# EAGLE design Memory Board V2 (EAGLE 6.5.0)
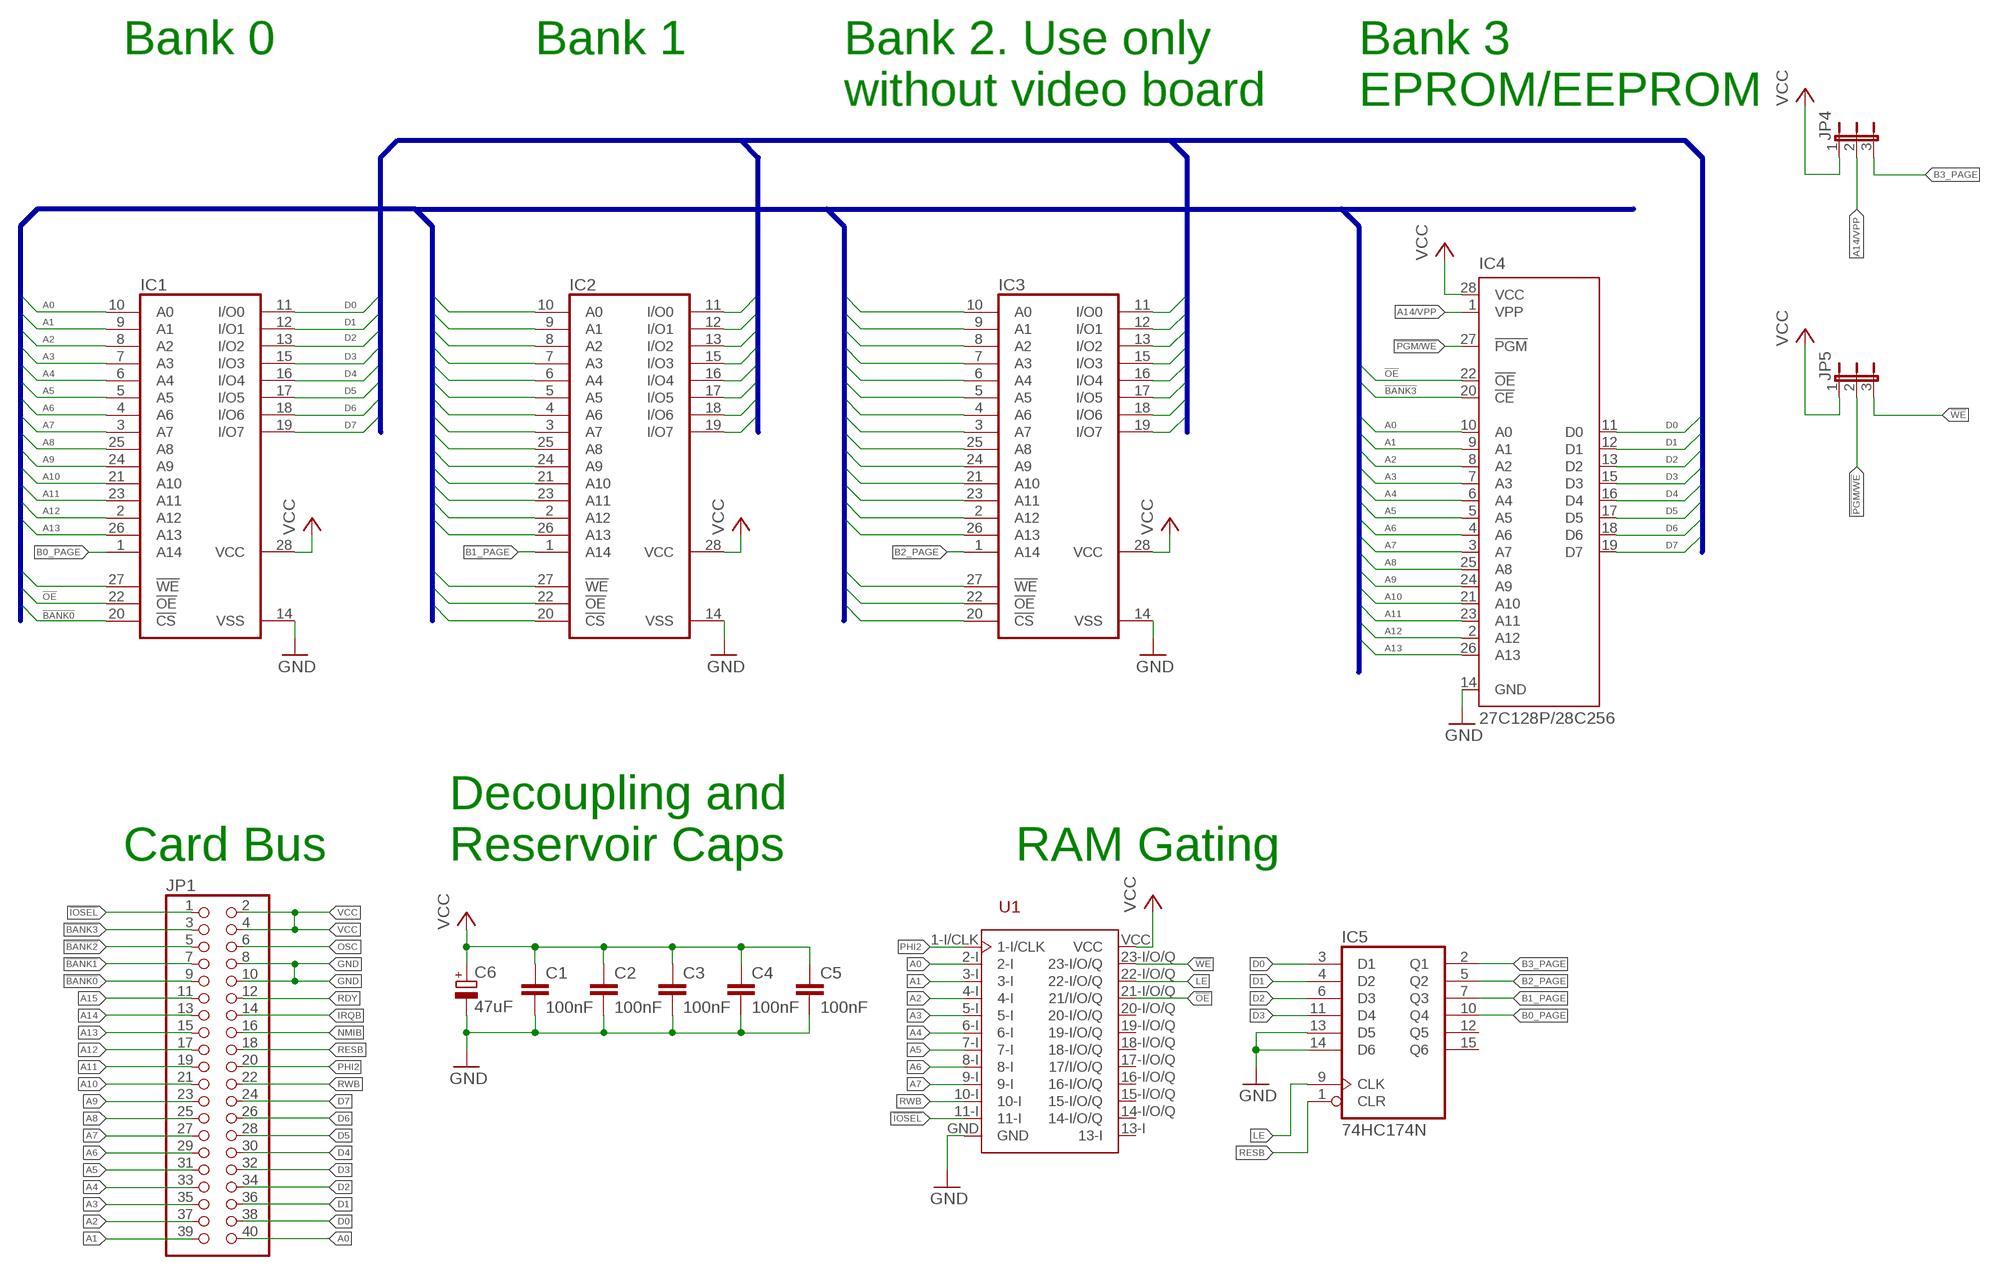
[diagram p0: schematic, sheet 1]

## Parts
C1  100nF  C-EU050-025X075  [C050-025X075]
C2  100nF  C-EU050-025X075  [C050-025X075]
C3  100nF  C-EU050-025X075  [C050-025X075]
C4  100nF  C-EU050-025X075  [C050-025X075]
C5  100nF  C-EU050-025X075  [C050-025X075]
C6  47uF  CPOL-EUE2.5-7  [E2,5-7]
IC1  62256P  [DIL28-6]
IC2  62256P  [DIL28-6]
IC3  62256P  [DIL28-6]
IC4  27C128P/28C256  27C128P  [DIL28-6]
IC5  74HC174N  [DIL16]
JP1  PINHD-2X20/90  [2X20/90]
JP4  JP2E  [JP2]
JP5  JP2E  [JP2]
U1  GAL22V10D-DIP  [DIP24]

## Nets
!BANK0: IC1.20(!CS) JP1.9
!BANK1: IC2.20(!CS) JP1.7
!BANK2: IC3.20(!CS) JP1.5
!BANK3: IC4.20(!CE) JP1.3
!IOSEL: JP1.1 U1.11-I
!OE: IC1.22(!OE) IC2.22(!OE) IC3.22(!OE) IC4.22(!OE) U1.21-I/O/Q(21/I/O/Q)
!PGM/WE: IC4.27(!PGM) JP5.2
!WE: IC1.27(!WE) IC2.27(!WE) IC3.27(!WE) JP5.3 U1.23-I/O/Q
A0: IC1.10(A0) IC2.10(A0) IC3.10(A0) IC4.10(A0) JP1.40 U1.2-I
A1: IC1.9(A1) IC2.9(A1) IC3.9(A1) IC4.9(A1) JP1.39 U1.3-I
A2: IC1.8(A2) IC2.8(A2) IC3.8(A2) IC4.8(A2) JP1.37 U1.4-I
A3: IC1.7(A3) IC2.7(A3) IC3.7(A3) IC4.7(A3) JP1.35 U1.5-I
A4: IC1.6(A4) IC2.6(A4) IC3.6(A4) IC4.6(A4) JP1.33 U1.6-I
A5: IC1.5(A5) IC2.5(A5) IC3.5(A5) IC4.5(A5) JP1.31 U1.7-I
A6: IC1.4(A6) IC2.4(A6) IC3.4(A6) IC4.4(A6) JP1.29 U1.8-I
A7: IC1.3(A7) IC2.3(A7) IC3.3(A7) IC4.3(A7) JP1.27 U1.9-I
A8: IC1.25(A8) IC2.25(A8) IC3.25(A8) IC4.25(A8) JP1.25
A9: IC1.24(A9) IC2.24(A9) IC3.24(A9) IC4.24(A9) JP1.23
A10: IC1.21(A10) IC2.21(A10) IC3.21(A10) IC4.21(A10) JP1.21
A11: IC1.23(A11) IC2.23(A11) IC3.23(A11) IC4.23(A11) JP1.19
A12: IC1.2(A12) IC2.2(A12) IC3.2(A12) IC4.2(A12) JP1.17
A13: IC1.26(A13) IC2.26(A13) IC3.26(A13) IC4.26(A13) JP1.15
A14: JP1.13
A14/VPP: IC4.1(VPP) JP4.2
A15: JP1.11
B0_PAGE: IC1.1(A14) IC5.10(Q4)
B1_PAGE: IC2.1(A14) IC5.7(Q3)
B2_PAGE: IC3.1(A14) IC5.5(Q2)
B3_PAGE: IC5.2(Q1) JP4.3
D0: IC1.11(I/O0) IC2.11(I/O0) IC3.11(I/O0) IC4.11(D0) IC5.3(D1) JP1.38
D1: IC1.12(I/O1) IC2.12(I/O1) IC3.12(I/O1) IC4.12(D1) IC5.4(D2) JP1.36
D2: IC1.13(I/O2) IC2.13(I/O2) IC3.13(I/O2) IC4.13(D2) IC5.6(D3) JP1.34
D3: IC1.15(I/O3) IC2.15(I/O3) IC3.15(I/O3) IC4.15(D3) IC5.11(D4) JP1.32
D4: IC1.16(I/O4) IC2.16(I/O4) IC3.16(I/O4) IC4.16(D4) JP1.30
D5: IC1.17(I/O5) IC2.17(I/O5) IC3.17(I/O5) IC4.17(D5) JP1.28
D6: IC1.18(I/O6) IC2.18(I/O6) IC3.18(I/O6) IC4.18(D6) JP1.26
D7: IC1.19(I/O7) IC2.19(I/O7) IC3.19(I/O7) IC4.19(D7) JP1.24
GND [power]: C1.2 C2.2 C3.2 C4.2 C5.2 C6.- IC1.14(VSS) IC2.14(VSS) IC3.14(VSS) IC4.14(GND) IC5.13(D5) IC5.14(D6) JP1.8 JP1.10 U1.GND
IRQB: JP1.14
LE: IC5.9(CLK) U1.22-I/O/Q
NMIB: JP1.16
OSC: JP1.6
PHI2: JP1.20 U1.1-I/CLK
RDY: JP1.12
RESB: IC5.1(CLR) JP1.18
RWB: JP1.22 U1.10-I
VCC [power]: C1.1 C2.1 C3.1 C4.1 C5.1 C6.+ IC1.28(VCC) IC2.28(VCC) IC3.28(VCC) IC4.28(VCC) JP1.2 JP1.4 JP4.1 JP5.1 U1.VCC
Unconnected: IC5.12(Q5) IC5.15(Q6) U1.13-I U1.14-I/O/Q U1.15-I/O/Q U1.16-I/O/Q U1.17-I/O/Q(17/I/O/Q) U1.18-I/O/Q U1.19-I/O/Q U1.20-I/O/Q

## Buses
D[0..7]
A[0..15],!OE,!BANK0,!BANK1,!BANK2,!BANK3,!WE

## Notes on the sheet
- Bank 0 | Bank 1
- Bank 2. Use only
  without video board
- Bank 3
  EPROM/EEPROM
- Card Bus
- Decoupling and
  Reservoir Caps
- RAM Gating

## Power pins joined to a net without a drawn wire
GND: IC5.8(GND)
VCC: IC5.16(VCC)

## Library data of the parts
C1-C5 = rcl:C-EU: CAPACITOR, European symbol
C6 = rcl:CPOL-EU: POLARIZED CAPACITOR, European symbol
IC1-IC3 = memory-hitachi:62256P: MEMORY; OC_FARNELL: unknown; OC_NEWARK: unknown
IC4 = microchip:27*128: CMOS EPROM 128 K (16 K x 8); OC_FARNELL: unknown; OC_NEWARK: unknown
IC5 = 74xx-eu:74*174: Hex D type FLIP FLOP, clear
JP1 = pinhead:PINHD-2X20: PIN HEADER
JP4 JP5 = jumper:JP2E: JUMPER
U1 = GAL22V10D:GAL22V10D-DIP: GAL22V10 Generic Array Logic

## Net classes
0 signal: width 0.254 mm, clearance 0.305 mm
1 power: width 0.61 mm, clearance 0.305 mm

## Board
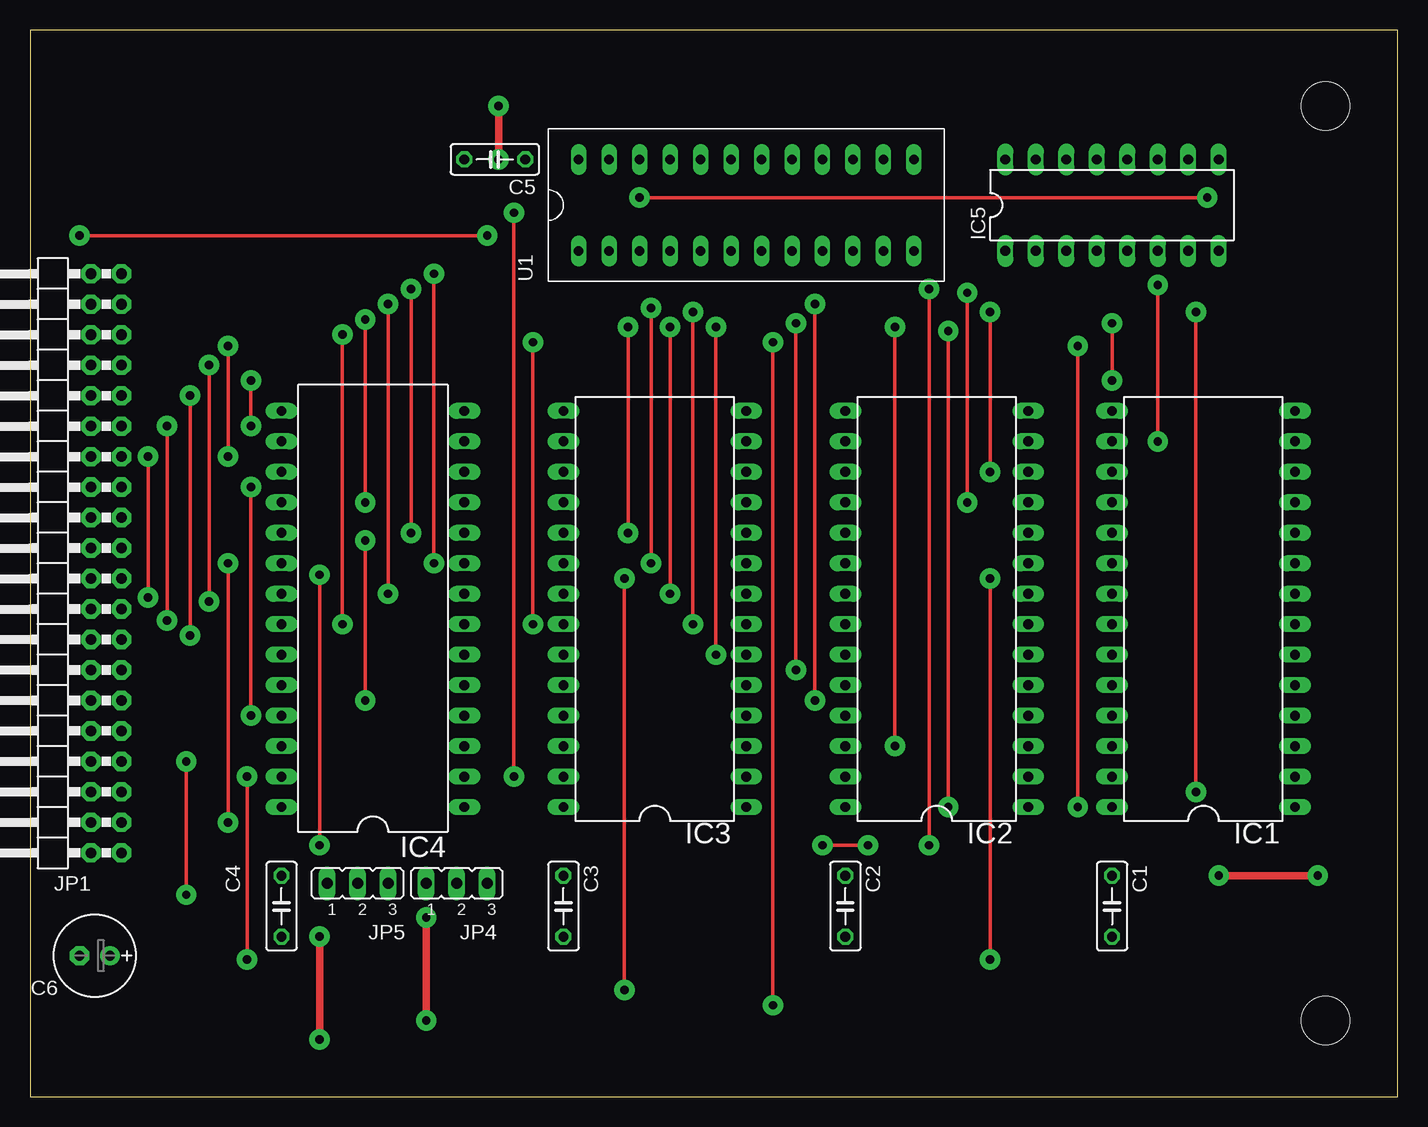
[diagram p1: board, top side]
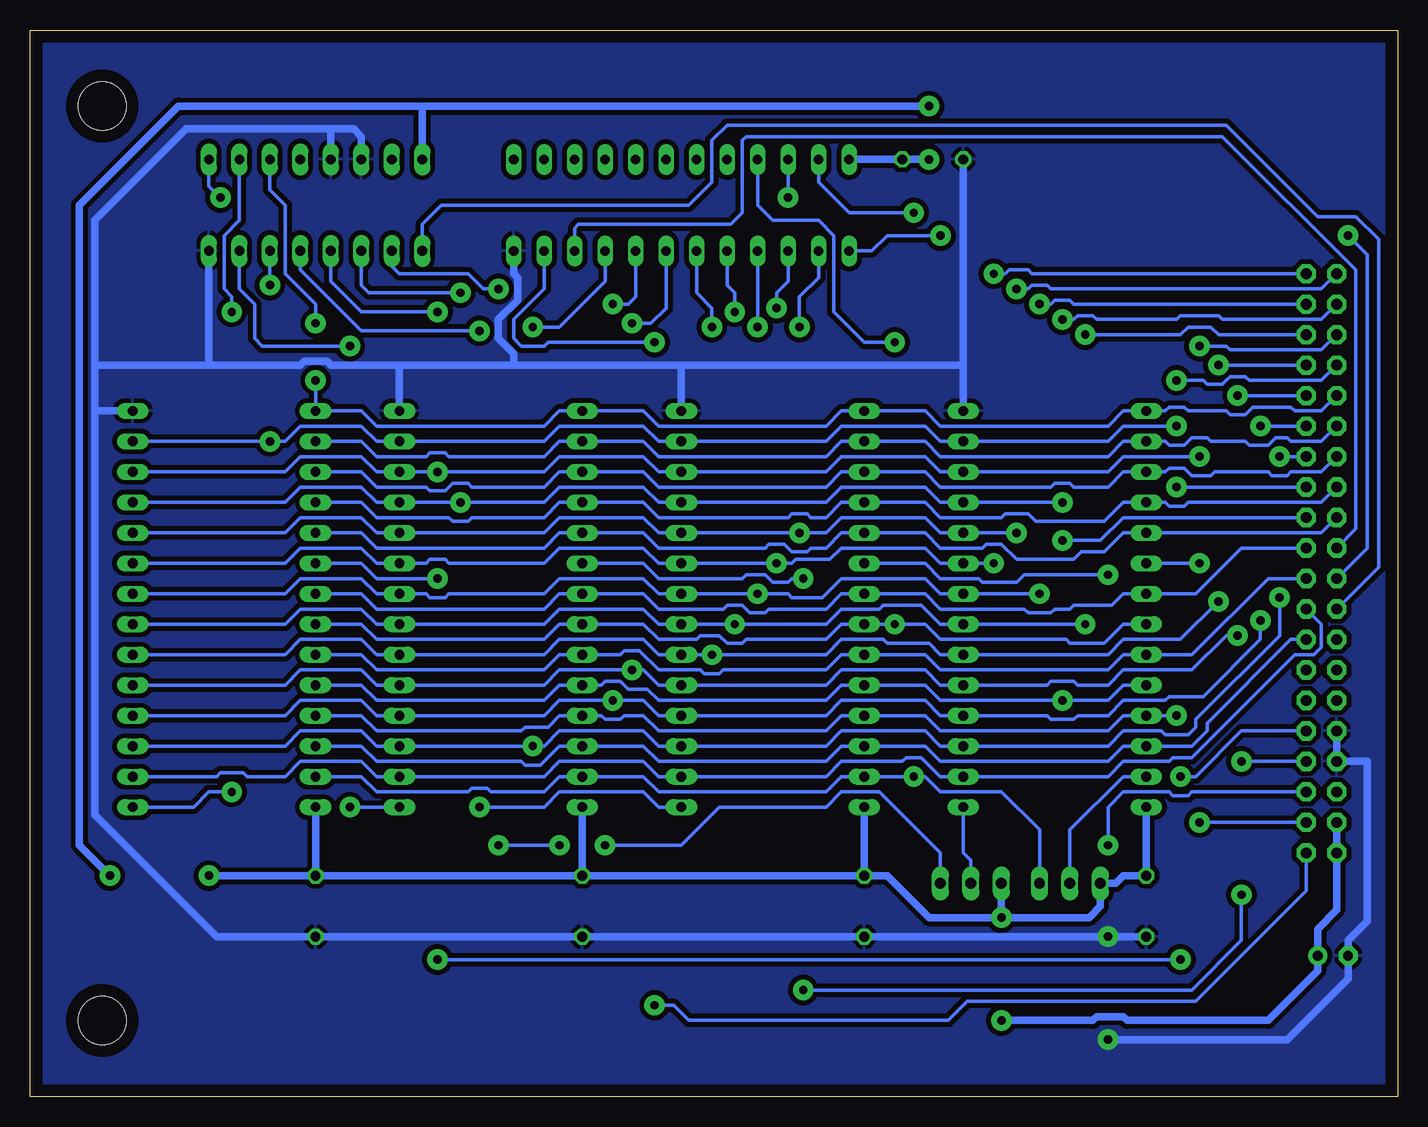
[diagram p2: board, bottom side, seen from below]

Size 113.97 x 88.89 mm. Coordinates in mm from the lower left corner, seen from the top.
Outline: 0,0 113.97,0 113.97,88.89 0,88.89 0,0
Copper layers (1*16): Top 0.035mm / dielectric 1.5mm / Bottom 0.035mm
Design rules "default *": minimum track width 10mil, minimum drill 24mil, track to track 8mil, track to pad 8mil, pad to pad 8mil, via to via 8mil, smd to smd 8mil, copper to edge 40mil, drill to drill 8mil, minimum pad ring 10mil, minimum via ring 16mil, stop-mask expansion 4mil, vias tented up to drill 0mil, thermal gap 14mil
Holes 4 mm at 107.95,82.55 107.95,6.35

### Footprints (pad centres in the part's own frame; a part is rotated, then mirrored left to right if it is on the bottom)
C050-025X075 = drill 0.813 octagon: 1 -2.54,0; 2 2.54,0
E2,5-7 = drill 0.813 pad 1.6: + -1.27,0 | drill 0.813 pad 1.6 octagon: - 1.27,0
DIL28-6 = drill 0.813 long: 1 -16.51,-7.62; 2 -13.97,-7.62; 3 -11.43,-7.62; 4 -8.89,-7.62; 5 -6.35,-7.62; 6 -3.81,-7.62; 7 -1.27,-7.62; 8 1.27,-7.62; 9 3.81,-7.62; 10 6.35,-7.62; 11 8.89,-7.62; 12 11.43,-7.62; 13 13.97,-7.62; 14 16.51,-7.62; 15 16.51,7.62; 16 13.97,7.62; 17 11.43,7.62; 18 8.89,7.62; 19 6.35,7.62; 20 3.81,7.62; 21 1.27,7.62; 22 -1.27,7.62; 23 -3.81,7.62; 24 -6.35,7.62; 25 -8.89,7.62; 26 -11.43,7.62; 27 -13.97,7.62; 28 -16.51,7.62
DIL16 = drill 0.813 long: 1 -8.89,-3.81; 2 -6.35,-3.81; 3 -3.81,-3.81; 4 -1.27,-3.81; 5 1.27,-3.81; 6 3.81,-3.81; 7 6.35,-3.81; 8 8.89,-3.81; 9 8.89,3.81; 10 6.35,3.81; 11 3.81,3.81; 12 1.27,3.81; 13 -1.27,3.81; 14 -3.81,3.81; 15 -6.35,3.81; 16 -8.89,3.81
2X20/90 = drill 0.889 pad 1.6 octagon: 1 -24.13,-6.35; 2 -24.13,-3.81; 3 -21.59,-6.35; 4 -21.59,-3.81; 5 -19.05,-6.35; 6 -19.05,-3.81; 7 -16.51,-6.35; 8 -16.51,-3.81; 9 -13.97,-6.35; 10 -13.97,-3.81; 11 -11.43,-6.35; 12 -11.43,-3.81; 13 -8.89,-6.35; 14 -8.89,-3.81; 15 -6.35,-6.35; 16 -6.35,-3.81; 17 -3.81,-6.35; 18 -3.81,-3.81; 19 -1.27,-6.35; 20 -1.27,-3.81; 21 1.27,-6.35; 22 1.27,-3.81; 23 3.81,-6.35; 24 3.81,-3.81; 25 6.35,-6.35; 26 6.35,-3.81; 27 8.89,-6.35; 28 8.89,-3.81; 29 11.43,-6.35; 30 11.43,-3.81; 31 13.97,-6.35; 32 13.97,-3.81; 33 16.51,-6.35; 34 16.51,-3.81; 35 19.05,-6.35; 36 19.05,-3.81; 37 21.59,-6.35; 38 21.59,-3.81; 39 24.13,-6.35; 40 24.13,-3.81
JP2 = drill 0.914 long: 1 -2.54,0; 2 0,0; 3 2.54,0
DIP24 = drill 0.8 long: 1-I/CLK -3.81,13.97; 2-I -3.81,11.43; 3-I -3.81,8.89; 4-I -3.81,6.35; 5-I -3.81,3.81; 6-I -3.81,1.27; 7-I -3.81,-1.27; 8-I -3.81,-3.81; 9-I -3.81,-6.35; 10-I -3.81,-8.89; 11-I -3.81,-11.43; 13-I 3.81,-13.97; 14-I/O/Q 3.81,-11.43; 15-I/O/Q 3.81,-8.89; 16-I/O/Q 3.81,-6.35; 17-I/O/Q 3.81,-3.81; 18-I/O/Q 3.81,-1.27; 19-I/O/Q 3.81,1.27; 20-I/O/Q 3.81,3.81; 21-I/O/Q 3.81,6.35; 22-I/O/Q 3.81,8.89; 23-I/O/Q 3.81,11.43; GND -3.81,-13.97; VCC 3.81,13.97

### Placement (x,y rotation side)
C1  90.17,15.88 270 top
C2  67.94,15.88 270 top
C3  44.45,15.88 270 top
C4  20.95,15.88 270 top
C5  38.73,78.11 180 top
C6  5.4,11.75 180 top
IC1  97.79,40.64 90 top
IC2  75.56,40.64 90 top
IC3  52.07,40.64 90 top
IC4  28.57,40.64 90 top
IC5  90.17,74.3 0 top
JP1  1.27,44.45 90 top
JP4  35.56,17.78 0 top
JP5  27.3,17.78 0 top
U1  59.69,74.3 90 top

### Tracks (layer width: path | path; a pad name or v marks a point on that pad's centre or on a via)
!BANK0  (via drill 0.7 pad 1.7)
  Top 0.305: v80.01,43.18 v80.01,11.43 | v18.1,11.43 v18.1,26.67
  Bottom 0.305: JP1.9 13.02,30.48 16.83,26.67 v18.1,26.67 | IC1.20 86.36,44.45 85.09,43.18 v80.01,43.18 | v80.01,11.43 v18.1,11.43
!BANK1  (via drill 0.7 pad 1.7)
  Top 0.305: v49.53,43.18 v49.53,8.89 | v13.02,16.83 v13.02,27.94
  Bottom 0.305: IC2.20 62.87,44.45 61.59,43.18 54.61,43.18 54.29,43.5 52.7,43.5 52.07,42.86 50.8,42.86 50.48,43.18 v49.53,43.18 | v49.53,8.89 17.14,8.89 13.02,13.02 v13.02,16.83 | v13.02,27.94 JP1.7
!BANK2  (via drill 0.7 pad 1.7)
  Top 0.305: v24.13,43.5 v24.13,20.95
  Bottom 0.305: IC3.20 39.37,44.45 38.1,43.18 34.92,43.18 34.61,42.86 31.75,42.86 31.11,43.5 v24.13,43.5 | v24.13,20.95 24.13,24.13 22.86,25.4 19.05,25.4 18.73,25.08 17.46,25.08 17.14,25.4 JP1.5
!BANK3  (via drill 0.7 pad 1.7)
  Top 0.305: v16.51,22.86 v16.51,44.45
  Bottom 0.305: JP1.3 v16.51,22.86 | v16.51,44.45 IC4.20
!IOSEL  (via drill 0.7 pad 1.7)
  Top 0.305: v61.91,7.62 v61.91,62.87
  Bottom 0.305: JP1.1 7.62,17.14 16.83,7.94 35.88,7.94 37.47,6.35 59.05,6.35 60.33,7.62 v61.91,7.62 | v61.91,62.87 70.8,62.87 71.12,62.55 73.03,62.55 73.66,63.18 73.66,64.77 71.12,67.31 U1.11-I
!OE  (via drill 0.7 pad 1.7)
  Top 0.305: v41.91,62.87 v41.91,39.37
  Bottom 0.305: IC1.22 86.36,39.37 85.09,38.1 71.12,38.1 69.85,39.37 IC2.22 62.87,39.37 61.59,38.1 58.42,38.1 58.1,38.42 56.52,38.42 55.88,37.78 54.61,37.78 54.29,38.1 47.62,38.1 46.35,39.37 IC3.22 v41.91,39.37 39.37,39.37 38.1,38.1 27.62,38.1 27.3,37.78 24.45,37.78 24.13,38.1 22.86,39.37 IC4.22 | U1.21-I/O/Q 53.34,74.3 52.07,73.03 48.26,73.03 46.99,71.75 46.99,65.41 44.45,62.87 v41.91,62.87
!PGM/WE
  Bottom 0.305: IC4.27 22.86,26.67 27.3,22.23 JP5.2
!WE  (via drill 0.7 pad 1.7)
  Top 0.305: v40.32,73.66 v40.32,26.67
  Bottom 0.305: IC1.27 86.36,26.67 85.09,25.4 77.47,25.4 77.15,25.72 75.88,25.72 75.56,25.4 71.12,25.4 69.85,26.67 IC2.27 62.87,26.67 61.59,25.4 47.62,25.4 46.35,26.67 IC3.27 v40.32,26.67 39.37,26.67 38.1,25.4 33.02,25.4 29.84,22.23 JP5.3 | U1.23-I/O/Q 48.26,76.2 45.72,73.66 v40.32,73.66
A0  (via drill 0.7 pad 1.7)
  Top 0.305: v49.85,64.14 v49.85,46.99 | v31.75,67.31 v31.75,46.99
  Bottom 0.305: IC1.10 92.71,46.99 91.44,48.26 86.36,48.26 85.09,46.99 IC2.10 71.12,46.99 69.85,48.26 62.87,48.26 61.59,46.99 IC3.10 v49.85,46.99 47.62,46.99 46.35,48.26 39.37,48.26 38.1,46.99 IC4.10 v31.75,46.99 | U1.2-I 48.26,68.26 49.85,66.67 v49.85,64.14 | JP1.40 6.35,67.31 28.89,67.31 29.21,67.63 30.48,67.63 30.8,67.31 v31.75,67.31
A1  (via drill 0.7 pad 1.7)
  Top 0.305: v51.75,65.72 v51.75,44.45 | v33.66,68.58 v33.66,44.45
  Bottom 0.305: IC1.9 92.71,44.45 91.44,45.72 86.36,45.72 85.09,44.45 IC2.9 80.96,44.45 80.64,44.77 79.38,44.77 79.06,44.45 71.12,44.45 69.85,45.72 62.87,45.72 61.59,44.45 IC3.9 v51.75,44.45 50.48,44.45 50.16,44.77 47.31,44.77 46.35,45.72 39.37,45.72 38.1,44.45 IC4.9 v33.66,44.45 | U1.3-I 50.8,67.94 51.75,66.99 v51.75,65.72 | JP1.39 30.48,68.58 30.8,68.9 32.38,68.9 32.7,68.58 v33.66,68.58
A2  (via drill 0.7 pad 1.7)
  Top 0.305: v53.34,64.14 v53.34,41.91 | v29.84,66.04 v29.84,41.91
  Bottom 0.305: IC1.8 92.71,41.91 91.44,43.18 86.36,43.18 85.09,41.91 IC2.8 80.96,41.91 80.64,41.59 79.38,41.59 79.06,41.91 71.12,41.91 69.85,43.18 62.87,43.18 61.59,41.91 IC3.8 v53.34,41.91 50.8,41.91 50.48,41.59 47.94,41.59 46.35,43.18 39.37,43.18 38.1,41.91 IC4.8 v29.84,41.91 | U1.4-I v53.34,64.14 | JP1.37 26.99,66.04 27.3,66.36 28.57,66.36 28.89,66.04 v29.84,66.04
A3  (via drill 0.7 pad 1.7)
  Top 0.305: v55.24,65.41 v55.24,39.37 | v26.04,63.5 v26.04,39.37
  Bottom 0.305: IC1.7 92.71,39.37 91.44,40.64 86.36,40.64 85.09,39.37 IC2.7 71.12,39.37 69.85,40.64 62.87,40.64 61.59,39.37 IC3.7 v55.24,39.37 47.62,39.37 46.35,40.64 43.18,40.64 42.86,40.96 39.69,40.96 38.1,39.37 IC4.7 v26.04,39.37 | U1.5-I 55.88,67.63 55.24,66.99 v55.24,65.41 | JP1.35 14.92,63.5 15.56,64.14 17.46,64.14 18.1,63.5 v26.04,63.5
A4  (via drill 0.7 pad 1.7)
  Top 0.305: v57.15,64.14 v57.15,36.83 | v14.92,60.96 v14.92,41.27
  Bottom 0.305: IC1.6 92.71,36.83 91.44,38.1 86.36,38.1 85.09,36.83 IC2.6 71.12,36.83 69.85,38.1 62.87,38.1 61.59,36.83 IC3.6 v57.15,36.83 47.62,36.83 46.35,38.1 42.86,38.1 42.55,37.78 39.05,37.78 38.1,36.83 IC4.6 24.13,36.83 22.86,38.1 18.1,38.1 v14.92,41.27 | U1.6-I 58.42,66.99 57.15,65.72 v57.15,64.14 | JP1.33 v14.92,60.96
A5  (via drill 0.7 pad 1.7)
  Top 0.305: v63.82,64.45 v63.82,35.56 | v13.34,58.42 v13.34,38.42
  Bottom 0.305: IC1.5 92.71,34.29 91.44,35.56 86.36,35.56 85.09,34.29 IC2.5 71.12,34.29 69.85,35.56 v63.82,35.56 62.87,35.56 61.59,34.29 IC3.5 47.62,34.29 46.35,35.56 39.37,35.56 38.1,34.29 IC4.5 29.21,34.29 28.89,34.61 26.99,34.61 26.67,34.29 24.13,34.29 22.86,35.56 17.14,35.56 14.29,38.42 v13.34,38.42 | U1.7-I 60.96,65.72 62.23,64.45 v63.82,64.45 | JP1.31 v13.34,58.42
A6  (via drill 0.7 pad 1.7)
  Top 0.305: v65.41,66.04 v65.41,33.02 | v11.43,55.88 v11.43,39.69
  Bottom 0.305: IC1.4 92.71,31.75 91.44,33.02 86.36,33.02 85.09,31.75 IC2.4 71.12,31.75 69.85,33.02 v65.41,33.02 62.87,33.02 61.59,31.75 IC3.4 47.62,31.75 46.35,33.02 39.37,33.02 38.1,31.75 IC4.4 29.21,31.75 28.89,31.43 26.99,31.43 26.67,31.75 24.13,31.75 22.86,33.02 19.37,33.02 19.05,33.34 16.19,33.34 11.43,38.1 v11.43,39.69 | U1.8-I 63.5,66.67 64.14,66.04 v65.41,66.04 | JP1.29 v11.43,55.88
A7  (via drill 0.7 pad 1.7)
  Top 0.305: v72.07,64.14 v72.07,29.21 | v9.84,53.34 v9.84,41.59
  Bottom 0.305: IC1.3 92.71,29.21 91.44,30.48 86.36,30.48 85.09,29.21 IC2.3 v72.07,29.21 71.12,29.21 69.85,30.48 62.87,30.48 61.59,29.21 IC3.3 47.62,29.21 46.35,30.48 39.37,30.48 38.1,29.21 IC4.3 24.13,29.21 22.86,30.48 19.68,30.48 19.37,30.16 17.46,30.16 16.83,30.8 16.83,31.43 9.84,38.42 v9.84,41.59 | JP1.27 v9.84,53.34 | U1.9-I 66.04,67.94 69.85,64.14 v72.07,64.14
A8  (via drill 0.7 pad 1.7)
  Top 0.305: v18.41,50.8 v18.41,31.75
  Bottom 0.305: IC1.25 86.36,31.75 85.09,30.48 73.03,30.48 72.71,30.8 70.8,30.8 69.85,31.75 IC2.25 66.36,31.75 66.04,31.43 64.77,31.43 64.45,31.75 62.87,31.75 61.59,30.48 47.62,30.48 46.35,31.75 IC3.25 39.37,31.75 38.1,30.48 24.13,30.48 22.86,31.75 IC4.25 v18.41,31.75 | JP1.25 v18.41,50.8
A9  (via drill 0.7 pad 1.7)
  Top 0.305: v27.94,46.35 v27.94,33.02
  Bottom 0.305: IC1.24 86.36,34.29 85.09,33.02 71.12,33.02 69.85,34.29 IC2.24 66.36,34.29 66.04,34.61 64.77,34.61 64.14,33.97 62.55,33.97 61.59,33.02 47.62,33.02 46.35,34.29 IC3.24 39.37,34.29 38.1,33.02 v27.94,33.02 24.13,33.02 22.86,34.29 IC4.24 | JP1.23 22.86,48.26 24.77,46.35 v27.94,46.35
A10
  Bottom 0.305: IC1.21 86.36,41.91 85.09,40.64 71.12,40.64 69.85,41.91 IC2.21 62.87,41.91 61.59,40.64 56.2,40.64 55.88,40.96 54.61,40.96 53.98,40.32 52.7,40.32 52.39,40.64 47.62,40.64 46.35,41.91 IC3.21 39.37,41.91 38.1,40.64 31.11,40.64 30.8,40.32 28.89,40.32 28.57,40.64 27.3,40.64 26.99,40.96 23.81,40.96 22.86,41.91 IC4.21 16.83,41.91 13.02,45.72 JP1.21
A11
  Bottom 0.305: IC1.23 86.36,36.83 85.09,35.56 71.12,35.56 69.85,36.83 IC2.23 64.77,36.83 64.45,37.15 63.18,37.15 61.59,35.56 58.1,35.56 57.78,35.24 56.52,35.24 56.2,35.56 47.62,35.56 46.35,36.83 IC3.23 39.37,36.83 38.1,35.56 24.13,35.56 22.86,36.83 IC4.23 17.14,36.83 10.79,43.18 JP1.19
A12
  Bottom 0.305: IC1.2 98.42,26.67 98.11,26.99 96.2,26.99 95.89,26.67 92.71,26.67 91.44,27.94 86.36,27.94 85.09,26.67 IC2.2 71.12,26.67 69.85,27.94 62.87,27.94 61.59,26.67 IC3.2 47.62,26.67 46.35,27.94 41.27,27.94 40.96,28.26 39.69,28.26 38.1,26.67 IC4.2 24.13,26.67 22.86,27.94 19.05,27.94 18.73,28.26 17.14,28.26 8.57,36.83 6.99,36.83 6.35,37.47 6.35,39.37 JP1.17
A13
  Bottom 0.305: IC1.26 86.36,29.21 85.09,27.94 73.03,27.94 72.71,27.62 71.44,27.62 69.85,29.21 IC2.26 62.87,29.21 61.59,27.94 47.62,27.94 46.35,29.21 IC3.26 39.37,29.21 38.1,27.94 24.13,27.94 22.86,29.21 IC4.26 17.14,29.21 15.88,30.48 15.88,31.11 8.89,38.1 JP1.15
A14/VPP
  Bottom 0.305: IC4.1 36.2,20.32 35.56,19.68 JP4.2
B0_PAGE  (via drill 0.7 pad 1.7)
  Top 0.305: v97.16,25.4 v97.16,65.41
  Bottom 0.305: IC1.1 100.33,24.13 99.06,25.4 v97.16,25.4 | v97.16,65.41 97.16,66.67 97.79,67.31 97.79,71.75 96.52,73.03 IC5.10
B1_PAGE  (via drill 0.7 pad 1.7)
  Top 0.305: v87.31,62.55 v87.31,24.13
  Bottom 0.305: IC5.7 96.52,67.31 95.25,66.04 95.25,63.18 94.61,62.55 v87.31,62.55 | v87.31,24.13 IC2.1
B2_PAGE  (via drill 0.7 pad 1.7)
  Top 0.305: v76.52,63.82 v76.52,24.13
  Bottom 0.305: IC5.5 91.44,68.9 86.36,63.82 v76.52,63.82 | v76.52,24.13 71.12,24.13 69.85,25.4 62.87,25.4 61.59,24.13 IC3.1
B3_PAGE  (via drill 0.7 pad 1.7)
  Top 0.305: v74.93,67.31 v74.93,20.95 | v66.04,20.95 v69.85,20.95
  Bottom 0.305: JP4.3 38.1,20.32 43.18,25.4 46.35,25.4 47.62,24.13 56.52,24.13 59.69,20.95 v66.04,20.95 | IC5.2 83.82,69.22 83.19,68.58 77.47,68.58 76.2,67.31 v74.93,67.31 | v69.85,20.95 v74.93,20.95
D0  (via drill 0.7 pad 1.7)
  Top 0.305: v78.11,66.99 v78.11,49.53 | v27.94,64.77 v27.94,49.53
  Bottom 0.305: IC1.11 92.71,49.53 91.44,50.8 86.36,50.8 85.09,49.53 IC2.11 v78.11,49.53 71.12,49.53 69.85,50.8 62.87,50.8 61.59,49.53 IC3.11 47.62,49.53 46.35,50.8 39.37,50.8 38.1,49.53 IC4.11 v27.94,49.53 | IC5.3 86.36,67.63 85.72,66.99 v78.11,66.99 | JP1.38 6.35,64.77 14.61,64.77 14.92,65.09 18.1,65.09 18.41,64.77 25.08,64.77 25.4,65.09 26.67,65.09 26.99,64.77 v27.94,64.77
D1  (via drill 0.7 pad 1.7)
  Top 0.305: v80.01,65.41 v80.01,52.07 | v16.51,62.55 v16.51,53.34
  Bottom 0.305: IC1.12 92.71,52.07 91.44,53.34 86.36,53.34 85.09,52.07 IC2.12 v80.01,52.07 71.12,52.07 69.85,53.34 62.87,53.34 61.59,52.07 IC3.12 47.62,52.07 46.35,53.34 39.37,53.34 38.1,52.07 IC4.12 24.13,52.07 22.86,53.34 v16.51,53.34 | IC5.4 88.9,67.94 86.36,65.41 v80.01,65.41 | JP1.36 6.35,62.23 13.97,62.23 14.29,62.55 v16.51,62.55
D2  (via drill 0.7 pad 1.7)
  Top 0.305: v93.98,67.63 v93.98,54.61 | v18.41,55.88 v18.41,59.69
  Bottom 0.305: IC1.13 v93.98,54.61 92.71,54.61 91.44,55.88 86.36,55.88 85.09,54.61 IC2.13 71.12,54.61 69.85,55.88 62.87,55.88 61.59,54.61 IC3.13 47.62,54.61 46.35,55.88 39.37,55.88 38.1,54.61 IC4.13 24.13,54.61 22.86,55.88 v18.41,55.88 | IC5.6 v93.98,67.63 | JP1.34 6.35,59.69 12.38,59.69 12.7,60.01 13.97,60.01 14.29,59.69 14.61,59.37 15.88,59.37 16.19,59.69 v18.41,59.69
D3  (via drill 0.7 pad 1.7)
  Top 0.305: v90.17,64.45 v90.17,59.69
  Bottom 0.305: IC5.11 93.98,75.56 92.71,74.3 92.71,68.58 90.17,66.04 v90.17,64.45 | v90.17,59.69 IC1.15 86.36,57.15 85.09,55.88 71.12,55.88 69.85,57.15 IC2.15 62.87,57.15 61.59,55.88 47.62,55.88 46.35,57.15 IC3.15 39.37,57.15 38.1,55.88 24.13,55.88 22.86,57.15 IC4.15 19.37,57.15 19.05,57.47 17.78,57.47 17.46,57.15 14.29,57.15 13.97,56.83 12.7,56.83 12.06,57.47 8.89,57.47 8.57,57.15 6.35,57.15 JP1.32
D4
  Bottom 0.305: IC1.16 86.36,54.61 85.09,53.34 80.96,53.34 80.64,53.66 79.38,53.66 79.06,53.34 71.12,53.34 69.85,54.61 IC2.16 62.87,54.61 61.59,53.34 47.62,53.34 46.35,54.61 IC3.16 39.37,54.61 38.1,53.34 24.13,53.34 22.86,54.61 IC4.16 19.37,54.61 19.05,54.29 17.78,54.29 17.14,54.93 15.88,54.93 15.56,54.61 12.7,54.61 12.38,54.29 10.79,54.29 10.16,54.93 9.21,54.93 8.89,54.61 6.35,54.61 JP1.30
D5
  Bottom 0.305: IC1.17 86.36,52.07 85.09,50.8 80.96,50.8 80.64,50.48 79.38,50.48 78.74,51.12 77.47,51.12 77.15,50.8 71.12,50.8 69.85,52.07 IC2.17 62.87,52.07 61.59,50.8 47.62,50.8 46.35,52.07 IC3.17 39.37,52.07 38.1,50.8 28.89,50.8 28.57,51.12 27.3,51.12 26.99,50.8 24.13,50.8 22.86,52.07 IC4.17 19.37,52.07 19.05,52.39 17.78,52.39 17.14,51.75 15.56,51.75 15.24,52.07 10.79,52.07 10.48,51.75 9.21,51.75 8.89,52.07 6.35,52.07 JP1.28
D6
  Bottom 0.305: IC1.18 86.36,49.53 85.09,48.26 79.06,48.26 78.74,47.94 77.47,47.94 77.15,48.26 71.12,48.26 69.85,49.53 IC2.18 62.87,49.53 61.59,48.26 50.8,48.26 50.48,48.58 49.21,48.58 48.9,48.26 47.62,48.26 46.35,49.53 IC3.18 39.37,49.53 38.1,48.26 33.02,48.26 32.7,48.58 30.8,48.58 30.16,47.94 24.45,47.94 22.86,49.53 IC4.18 19.37,49.53 19.05,49.21 17.78,49.21 17.46,49.53 6.35,49.53 JP1.26
D7
  Bottom 0.305: IC1.19 86.36,46.99 85.09,45.72 71.12,45.72 69.85,46.99 IC2.19 62.87,46.99 61.59,45.72 52.7,45.72 52.39,46.04 51.12,46.04 50.48,45.4 49.21,45.4 48.9,45.72 47.62,45.72 46.35,46.99 IC3.19 39.37,46.99 38.1,45.72 34.61,45.72 34.29,46.04 33.02,46.04 31.75,44.77 26.99,44.77 26.35,45.4 24.45,45.4 22.86,46.99 IC4.19 6.35,46.99 JP1.24
GND  (via drill 0.7 pad 1.7)
  Top 0.61: v24.13,4.76 v24.13,13.34
  Bottom 0.61: 108.58,60.96 99.06,60.96 | 99.06,60.96 91.44,60.96 91.12,61.28 89.22,61.28 88.9,60.96 83.19,60.96 | 83.19,60.96 73.66,60.96 | 73.66,60.96 59.69,60.96 | 59.69,60.96 36.2,60.96 | 36.2,60.96 IC4.14 | 36.2,60.96 C5.2 | IC5.8 99.06,60.96 | IC2.14 83.19,60.96 | IC3.14 59.69,60.96 | U1.GND 73.66,68.58 73.34,68.26 73.34,66.36 74.93,64.77 74.93,63.18 73.66,61.91 73.66,60.96 | C4.2 v24.13,13.34 C3.2 C2.2 C1.2 98.42,13.34 108.58,23.5 108.58,57.15 | JP1.10 JP1.8 2.54,27.94 2.54,14.61 4.13,13.02 C6.- 4.13,9.84 9.21,4.76 v24.13,4.76 | IC1.14 108.58,57.15 | 88.9,80.64 100.97,80.64 108.58,73.03 108.58,60.96 | 108.58,60.96 108.58,57.15 | IC5.13 88.9,80.64 | 88.9,80.64 87,80.64 86.36,80.01 IC5.14
  pour Bottom (isolate 0.406): 0,88.9 114.3,88.9 114.3,0 -0.64,0 -0.64,88.27
LE  (via drill 0.7 pad 1.7)
  Top 0.305: v50.8,74.93 v98.11,74.93
  Bottom 0.305: U1.22-I/O/Q v50.8,74.93 | v98.11,74.93 99.06,75.88 IC5.9
PHI2  (via drill 0.7 pad 1.7)
  Top 0.305: v4.13,71.75 v38.1,71.75
  Bottom 0.305: JP1.20 2.54,45.72 2.54,70.17 v4.13,71.75 | v38.1,71.75 42.55,71.75 43.81,70.48 U1.1-I/CLK
RESB
  Bottom 0.305: JP1.18 1.59,44.13 1.59,71.44 3.49,73.34 6.67,73.34 14.29,80.96 55.88,80.96 57.15,79.69 57.15,76.2 59.05,74.3 79.69,74.3 81.28,72.71 IC5.1
RWB
  Bottom 0.305: JP1.22 3.49,47.31 3.49,68.9 14.61,80.01 54.29,80.01 54.61,79.69 54.61,73.66 55.56,72.71 68.26,72.71 68.58,72.39 U1.10-I
VCC  (via drill 0.7 pad 1.7)
  Top 0.61: v39.05,78.11 v39.05,82.55 | v107.31,18.41 v99.06,18.41 | v33.02,6.35 v33.02,14.92
  Bottom 0.61: IC1.28 C1.1 | C1.1 C2.1 | IC2.28 C2.1 | C2.1 C3.1 | IC3.28 C3.1 | C3.1 42.55,18.41 39.05,14.92 v33.02,14.92 | v33.02,14.92 25.72,14.92 24.77,15.88 JP5.1 23.5,17.78 22.86,18.41 C4.1 IC4.28 | JP4.1 v33.02,14.92 | C5.1 v39.05,78.11 U1.VCC | JP1.4 JP1.2 5.08,15.56 6.67,13.97 C6.+ 6.67,10.48 10.79,6.35 22.54,6.35 22.86,6.67 25.08,6.67 25.4,6.35 v33.02,6.35 | 81.28,82.55 101.6,82.55 109.86,74.3 109.86,20.95 v107.31,18.41 | 81.28,82.55 v39.05,82.55 | v99.06,18.41 C1.1 | IC5.16 81.28,82.55